# EAGLE design LED_BAR (EAGLE 7.2.0)
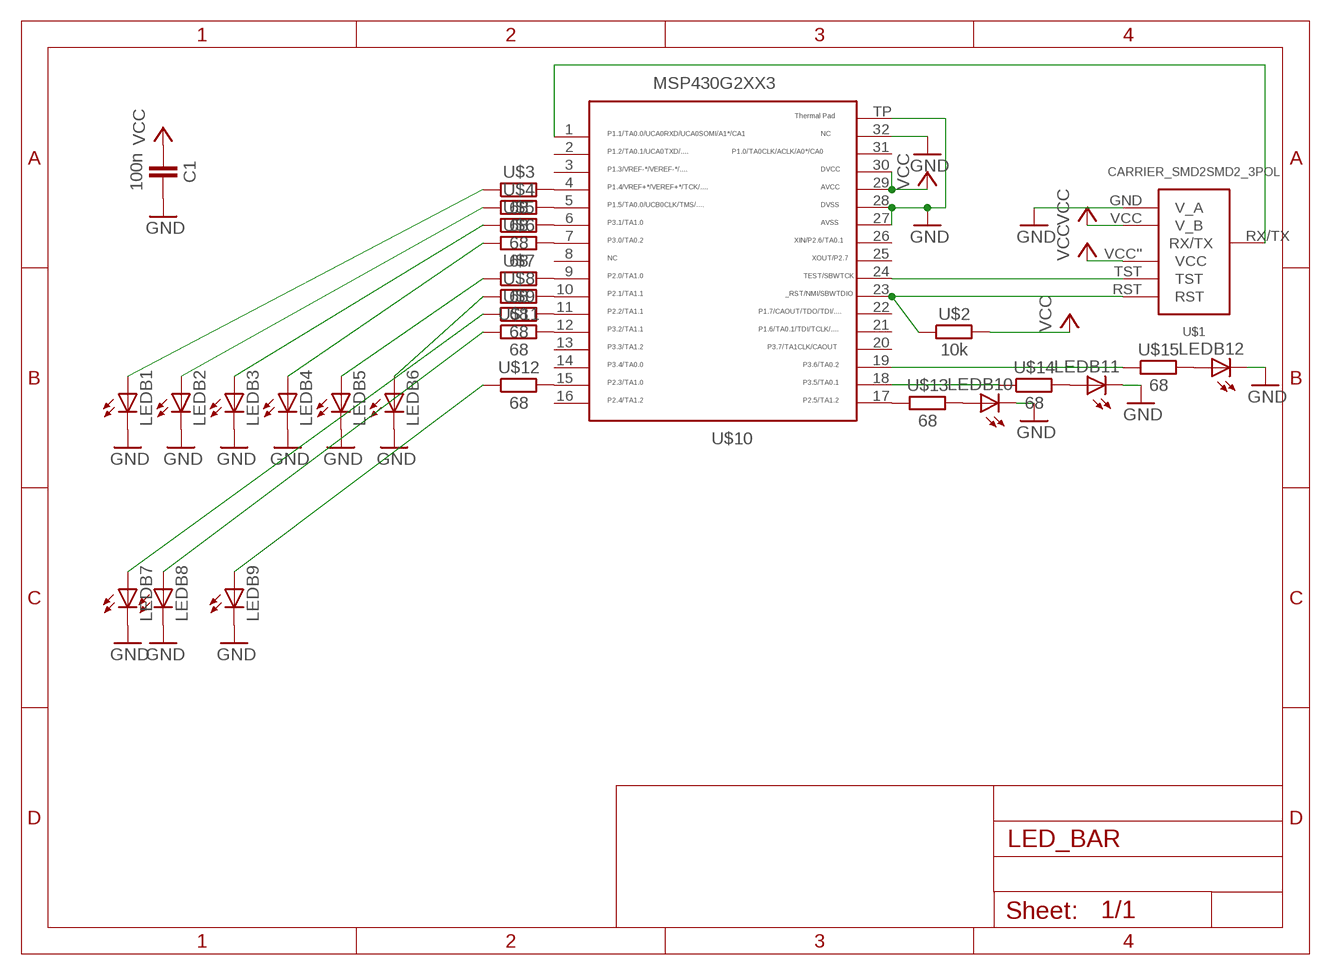
[diagram p0: schematic, sheet 1]

## Parts
C1  100n  CAPACITOR  [603]
LEDB1  LEDCHIPLED_0603  [CHIPLED_0603]
LEDB2  LEDCHIPLED_0603  [CHIPLED_0603]
LEDB3  LEDCHIPLED_0603  [CHIPLED_0603]
LEDB4  LEDCHIPLED_0603  [CHIPLED_0603]
LEDB5  LEDCHIPLED_0603  [CHIPLED_0603]
LEDB6  LEDCHIPLED_0603  [CHIPLED_0603]
LEDB7  LEDCHIPLED_0603  [CHIPLED_0603]
LEDB8  LEDCHIPLED_0603  [CHIPLED_0603]
LEDB9  LEDCHIPLED_0603  [CHIPLED_0603]
LEDB10  LEDCHIPLED_0603  [CHIPLED_0603]
LEDB11  LEDCHIPLED_0603  [CHIPLED_0603]
LEDB12  LEDCHIPLED_0603  [CHIPLED_0603]
U$1  CARRIER_SMD2SMD2_3POL  [CARRIER_SMD2_3POL]
U$2  10k  RESISTOR0603  [603]
U$3  68  RESISTOR0603  [603]
U$4  68  RESISTOR0603  [603]
U$5  68  RESISTOR0603  [603]
U$6  68  RESISTOR0603  [603]
U$7  68  RESISTOR0603  [603]
U$8  68  RESISTOR0603  [603]
U$9  68  RESISTOR0603  [603]
U$10  MSP430G2553  [QFN32]
U$11  68  RESISTOR0603  [603]
U$12  68  RESISTOR0603  [603]
U$13  68  RESISTOR0603  [603]
U$14  68  RESISTOR0603  [603]
U$15  68  RESISTOR0603  [603]

## Nets
GND: C1.2 LEDB1.C LEDB2.C LEDB3.C LEDB4.C LEDB5.C LEDB6.C LEDB7.C LEDB8.C LEDB9.C LEDB10.C LEDB11.C LEDB12.C U$1.GND(V_A) U$10.27 U$10.28 U$10.32 U$10.TP
N$3: U$1.TST U$10.24
N$4: U$1.RST U$2.1 U$10.23
N$5: LEDB1.A U$3.1
N$6: LEDB2.A U$4.1
N$7: LEDB3.A U$5.1
N$11: U$3.2 U$10.4
N$12: U$1.RX/TX U$10.1
N$13: LEDB4.A U$6.1
N$14: LEDB5.A U$7.1
N$16: LEDB6.A U$8.1
N$17: U$4.2 U$10.5
N$18: LEDB7.A U$9.1
N$19: LEDB8.A U$11.1
N$20: LEDB9.A U$12.1
N$21: U$5.2 U$10.6
N$22: U$6.2 U$10.7
N$23: U$7.2 U$10.9
N$24: U$10.19 U$15.1
N$25: U$10.18 U$14.1
N$26: U$8.2 U$10.10
N$27: U$9.2 U$10.11
N$28: U$10.15 U$12.2
N$29: U$10.17 U$13.1
N$32: LEDB10.A U$13.2
N$34: LEDB11.A U$14.2
N$35: LEDB12.A U$15.2
N$36: U$10.12 U$11.2
VCC: C1.1 U$1.VCC''(VCC) U$1.VCC(V_B) U$2.2 U$10.29 U$10.30
Unconnected: U$10.2 U$10.3 U$10.8 U$10.13 U$10.14 U$10.16 U$10.20 U$10.21 U$10.22 U$10.25 U$10.26 U$10.31

## Library data of the parts
C1 = thar:CAPACITOR
LEDB1-LEDB12 = led:LED: LED OSRAM: - CHIPLED LG R971, LG N971, LY N971, LG Q971, LY Q971, LO R971, LY R971 LH N974, LH R974 LS Q976, LO Q976, LY Q976 LO Q996 - Hyper CHIPLED LW Q18S LB Q993, LB Q99A, LB R99A - SideLED LS A670, LO A670, LY A670, LG A670, LP A670 LB A673, LV A673, LT A673, LW A673 LH A674 LY A675 LS A676, LA A676, LO A676, LY A676, LW A676 LS A679, LY A679, LG A679 - Hyper Micro SIDELED® LS Y876, LA Y876, LO Y876, LY Y876 LT Y87S - SmartLED LW L88C, LW L88S LB L89C, LB L89S, LG L890 LS L89K, LO L89K, LY L89K LS L896, LA L896, LO L896, LY L896 - TOPLED LS T670, LO T670, LY T670, LG T670, LP T670 LSG T670, LSP T670, LSY T670, LOP T670, LYG T670 LG T671, LOG T671, LSG T671 LB T673, LV T673, LT T673, LW T673 LH T674 LS T676, LA T676, LO T676, LY T676, LB T676, LH T676, LSB T676, LW T676 LB T67C, LV T67C, LT T67C, LS T67K, LO T67K, LY T67K, LW E67C LS E67B, LA E67B, LO E67B, LY E67B, LB E67C, LV E67C, LT E67C LW T67C LS T679, LY T679, LG T679 LS T770, LO T770, LY T770, LG T770, LP T770 LB T773, LV T773, LT T773, LW T773 LH T774 LS E675, LA E675, LY E675, LS T675 LS T776, LA T776, LO T776, LY T776, LB T776 LHGB T686 LT T68C, LB T68C - Hyper Mini TOPLED® LB M676 - Mini TOPLED Santana® LG M470 LS M47K, LO M47K, LY M47K Source: http://www.osram.convergy.de LUXEON: - LUMILED® LXK2-PW12-R00, LXK2-PW12-S00, LXK2-PW14-U00, LXK2-PW14-V00 LXK2-PM12-R00, LXK2-PM12-S00, LXK2-PM14-U00 LXK2-PE12-Q00, LXK2-PE12-R00, LXK2-PE12-S00, LXK2-PE14-T00, LXK2-PE14-U00 LXK2-PB12-K00, LXK2-PB12-L00, LXK2-PB12-M00, LXK2-PB14-N00, LXK2-PB14-P00, LXK2-PB14-Q00 LXK2-PR12-L00, LXK2-PR12-M00, LXK2-PR14-Q00, LXK2-PR14-R00 LXK2-PD12-Q00, LXK2-PD12-R00, LXK2-PD12-S00 LXK2-PH12-R00, LXK2-PH12-S00 LXK2-PL12-P00, LXK2-PL12-Q00, LXK2-PL12-R00 Source: www.luxeon.com KINGBRIGHT: KA-3528ASYC Source: www.kingbright.com
U$1 = thar:CARRIER_SMD2
U$2-U$9 U$11-U$15 = thar:RESISTOR
U$10 = thar:MSP430G2553: TEXAS INSTRUMENTS MSP430G2553IRHB32R MCU, 16BIT, MSP430, 16MHZ, QFN-32 Farnell Best.Nr.: 2325726 Herst.Bez.: MSP430G2553IRHB32R

## Board
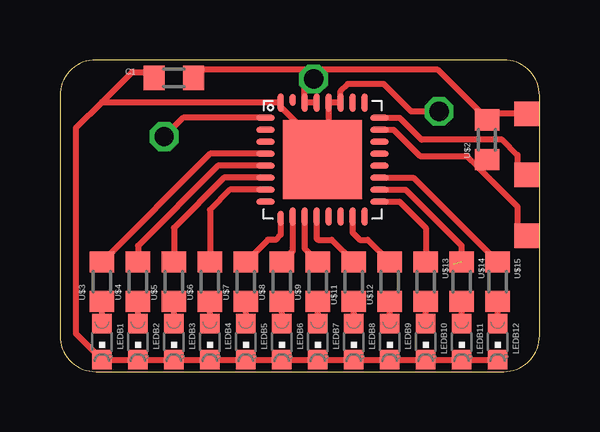
[diagram p1: board, top side]
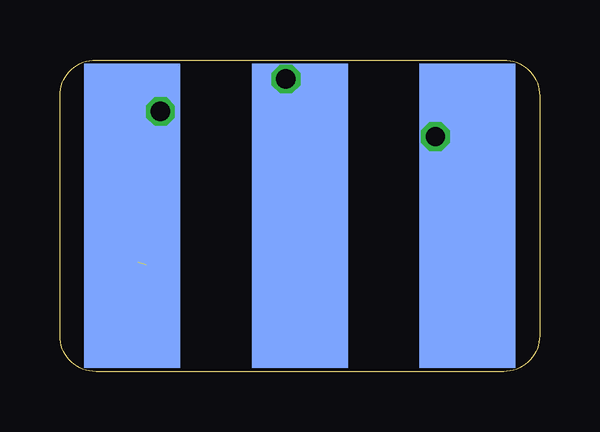
[diagram p2: board, bottom side, seen from below]

Size 20 x 13 mm. Coordinates in mm from the lower left corner, seen from the top.
Copper layers (1*16): Top 0.035mm / dielectric 1.5mm / Bottom 0.035mm
Design rules "Bilex DRU *": minimum track width 10mil, minimum drill 24mil, track to track 10mil, track to pad 10mil, pad to pad 10mil, via to via 10mil, smd to smd 10mil, copper to edge 1mil, drill to drill 8mil, minimum pad ring 10mil, minimum via ring 8mil, stop-mask expansion 4mil, vias tented up to drill 0mil, thermal gap 10mil

### Footprints (pad centres in the part's own frame; a part is rotated, then mirrored left to right if it is on the bottom)
603 = smd 0.889 x 1.016: 1 -0.826,0; 2 0.826,0
CHIPLED_0603 = smd 0.8 x 0.8: A 0,-0.75; C 0,0.75
CARRIER_SMD2_3POL = smd 4 x 12.7 bottom: GND -6.985,0; RX/TX 6.985,0; VCC 0,0 | smd 1.016 x 1.016: RST -9.461,0.826; TST -9.461,-1.714; VCC'' -9.461,-4.255
QFN32 = smd 0.762 x 0.254: 1 -2.375,1.75; 2 -2.375,1.25; 3 -2.375,0.75; 4 -2.375,0.25; 5 -2.375,-0.25; 6 -2.375,-0.75; 7 -2.375,-1.25; 8 -2.375,-1.75; 17 2.375,-1.75; 18 2.375,-1.25; 19 2.375,-0.75; 20 2.375,-0.25; 21 2.375,0.25; 22 2.375,0.75; 23 2.375,1.25; 24 2.375,1.75 | smd 0.254 x 0.635: 9 -1.75,-2.438 | smd 0.254 x 0.762: 10 -1.25,-2.375; 11 -0.75,-2.375; 12 -0.25,-2.375; 13 0.25,-2.375; 14 0.75,-2.375; 15 1.25,-2.375; 16 1.75,-2.375; 25 1.75,2.375; 26 1.25,2.375; 27 0.75,2.375; 28 0.25,2.375; 29 -0.25,2.375; 30 -0.75,2.375; 32 -1.75,2.375 | smd 0.254 x 0.508: 31 -1.25,2.5 | smd 3.302 x 3.302: TP 0,0

### Placement (x,y rotation side)
C1  4.75,12.25 180 top
LEDB1  1.75,1.25 180 top
LEDB2  3.25,1.25 180 top
LEDB3  4.75,1.25 180 top
LEDB4  6.25,1.25 180 top
LEDB5  7.75,1.25 180 top
LEDB6  9.25,1.25 180 top
LEDB7  10.75,1.25 180 top
LEDB8  12.25,1.25 180 top
LEDB9  13.75,1.25 180 top
LEDB10  15.25,1.25 180 top
LEDB11  16.75,1.25 180 top
LEDB12  18.25,1.25 180 top
U$1  10,6.5 180 top
U$2  17.81,9.67 90 top
U$3  1.75,3.75 90 top
U$4  3.25,3.75 90 top
U$5  4.75,3.75 90 top
U$6  6.25,3.75 90 top
U$7  7.75,3.75 90 top
U$8  9.25,3.75 90 top
U$9  10.75,3.75 90 top
U$10  10.95,8.84 0 top
U$11  12.25,3.75 90 top
U$12  13.75,3.75 90 top
U$13  15.25,3.75 270 top
U$14  16.75,3.75 270 top
U$15  18.25,3.75 270 top

### Tracks (layer width: path | path; a pad name or v marks a point on that pad's centre or on a via)
GND  (via drill 0.8)
  Top 0.254: 18.54,0.5 LEDB12.C LEDB11.C LEDB10.C LEDB9.C LEDB8.C LEDB7.C LEDB6.C LEDB5.C LEDB4.C LEDB3.C LEDB2.C LEDB1.C 0.67,1.58 0.67,10.17 1.75,11.25 | 10.19,9.04 10.19,8.6 U$10.TP 11.2,8.84 11.2,10.25 | 1.75,11.25 3,12.5 3.67,12.5 C1.2 | 1.75,11.25 9.2,11.25 U$10.32 | U$10.32 9.2,11.3 | 11.2,10.25 U$10.28 U$10.27 11.7,11.7 12,12 13.5,12 14.65,10.85 v15.81,10.85 | U$10.32 9.2,11.05 10,10.25 11.2,10.25
  Bottom 0.254: 18,6.5 16.06,10.94 v15.81,10.85 16.98,5.35 U$1.GND
N$3
  Top 0.254: U$1.TST 19.08,8.6 19.08,9.04 18.44,9.67 15.08,9.67 14.16,10.59 U$10.24
N$4
  Top 0.254: 17.43,8.53 19.08,6.88 19.08,5.67 U$1.RST | U$2.1 17.74,8.85 17.43,8.53 | U$10.23 13.91,10.09 15,9 16.96,9 17.43,8.53
N$5
  Top 0.254: LEDB1.A U$3.1
N$6
  Top 0.254: LEDB2.A U$4.1
N$7
  Top 0.254: LEDB3.A U$5.1
N$11
  Top 0.254: U$10.4 6.26,9.09 U$3.2
N$12  (via drill 0.8)
  Top 0.254: U$10.1 5.14,10.59 v4.35,9.8
  Bottom 0.254: U$1.RX/TX 3.01,8.47 v4.35,9.8
N$13
  Top 0.254: LEDB4.A U$6.1
N$14
  Top 0.254: LEDB5.A U$7.1
N$16
  Top 0.254: LEDB6.A U$8.1
N$17
  Top 0.254: U$10.5 6.59,8.59 3.25,5.25 U$4.2
N$18
  Top 0.254: LEDB7.A U$9.1
N$19
  Top 0.254: LEDB8.A U$11.1
N$20
  Top 0.254: LEDB9.A U$12.1
N$21
  Top 0.254: U$10.6 6.84,8.09 4.75,6 U$5.2
N$22
  Top 0.254: U$10.7 7.09,7.59 6.25,6.75 U$6.2
N$23
  Top 0.254: U$10.9 9.2,5.7 9,5.5 8.68,5.5 U$7.2
N$24
  Top 0.254: U$10.19 14.73,8.09 U$15.1
N$25  (1 unrouted)
  Top 0.254: 16.41,4.72 16.41,4.47 | U$10.18 14.41,7.59 16.75,5.25 U$14.1
N$26
  Top 0.254: U$10.10 9.7,5.03 U$8.2
N$27
  Top 0.254: U$10.11 10.2,5.12 U$9.2
N$28
  Top 0.254: U$10.15 12.2,5.8 12.5,5.5 12.82,5.5 U$12.2
N$29
  Top 0.254: U$10.17 14.16,7.09 15.25,6 U$13.1
N$32
  Top 0.254: LEDB10.A U$13.2
N$34
  Top 0.254: LEDB11.A U$14.2
N$35
  Top 0.254: LEDB12.A U$15.2
N$36
  Top 0.254: U$10.12 10.7,5.55 10.75,5.5 11.32,5.5 U$11.2
VCC  (via drill 0.8)
  Top 0.254: U$10.29 U$10.30 10.2,12.54 10.25,12.59 | U$1.VCC'' 17.68,10.76 | v10.58,12.21 10.58,12.59 | U$2.2 17.81,10.63 17.68,10.76 | 17.68,10.76 17.59,10.76 15.75,12.59 10.58,12.59 | 10.58,12.59 10.25,12.59 | 10.25,12.59 5.92,12.59 C1.1
  Bottom 0.254: U$1.VCC 10,10.63 v10.58,12.21